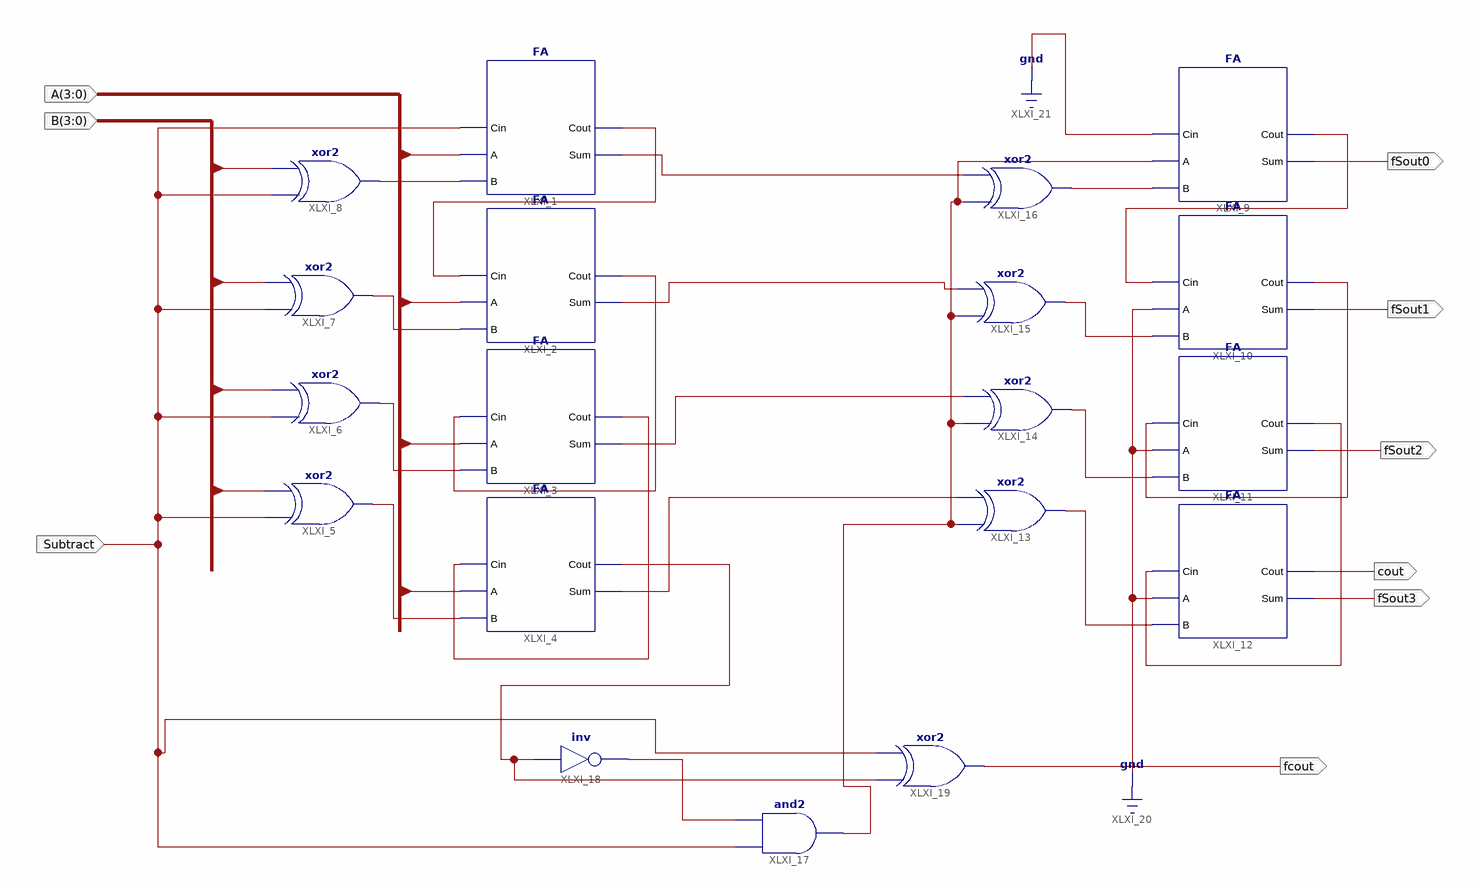
[diagram p0: schematic sheet 1]
// Xilinx ISE schematic cla.sch (spartan3e) as structural Verilog: 19 symbols, 9 ports
module cla (
  input  [3:0] A,
  input  [3:0] B,
  input  Subtract,
  output fSout0,
  output fSout1,
  output fSout2,
  output cout,
  output fSout3,
  output fcout
);

  wire carry, S0out, S1out, S2out, S3out, XLXN_3, XLXN_4, XLXN_5, XLXN_6, XLXN_8, XLXN_10, XLXN_12, XLXN_21,
       XLXN_22, XLXN_23, XLXN_24, XLXN_26, XLXN_28, XLXN_30, XLXN_36, XLXN_49;

  FA XLXI_1 (.Cin(Subtract), .Cout(XLXN_8), .A(A[0]), .B(XLXN_3), .Sum(S0out));
  FA XLXI_2 (.Cin(XLXN_8), .Cout(XLXN_10), .A(A[1]), .B(XLXN_4), .Sum(S1out));
  FA XLXI_3 (.Cin(XLXN_10), .Cout(XLXN_12), .A(A[2]), .B(XLXN_5), .Sum(S2out));
  FA XLXI_4 (.Cin(XLXN_12), .Cout(carry), .A(A[3]), .B(XLXN_6), .Sum(S3out));
  xor XLXI_5 (XLXN_6, Subtract, B[3]);
  xor XLXI_6 (XLXN_5, Subtract, B[2]);
  xor XLXI_7 (XLXN_4, Subtract, B[1]);
  xor XLXI_8 (XLXN_3, Subtract, B[0]);
  FA XLXI_9 (.Cin(1'b0), .Cout(XLXN_26), .A(XLXN_49), .B(XLXN_21), .Sum(fSout0));
  FA XLXI_10 (.Cin(XLXN_26), .Cout(XLXN_28), .A(1'b0), .B(XLXN_22), .Sum(fSout1));
  FA XLXI_11 (.Cin(XLXN_28), .Cout(XLXN_30), .A(1'b0), .B(XLXN_23), .Sum(fSout2));
  FA XLXI_12 (.Cin(XLXN_30), .Cout(cout), .A(1'b0), .B(XLXN_24), .Sum(fSout3));
  xor XLXI_13 (XLXN_24, XLXN_49, S3out);
  xor XLXI_14 (XLXN_23, XLXN_49, S2out);
  xor XLXI_15 (XLXN_22, XLXN_49, S1out);
  xor XLXI_16 (XLXN_21, XLXN_49, S0out);
  and XLXI_17 (XLXN_49, Subtract, XLXN_36);
  not XLXI_18 (XLXN_36, carry);
  xor XLXI_19 (fcout, carry, Subtract);
endmodule
